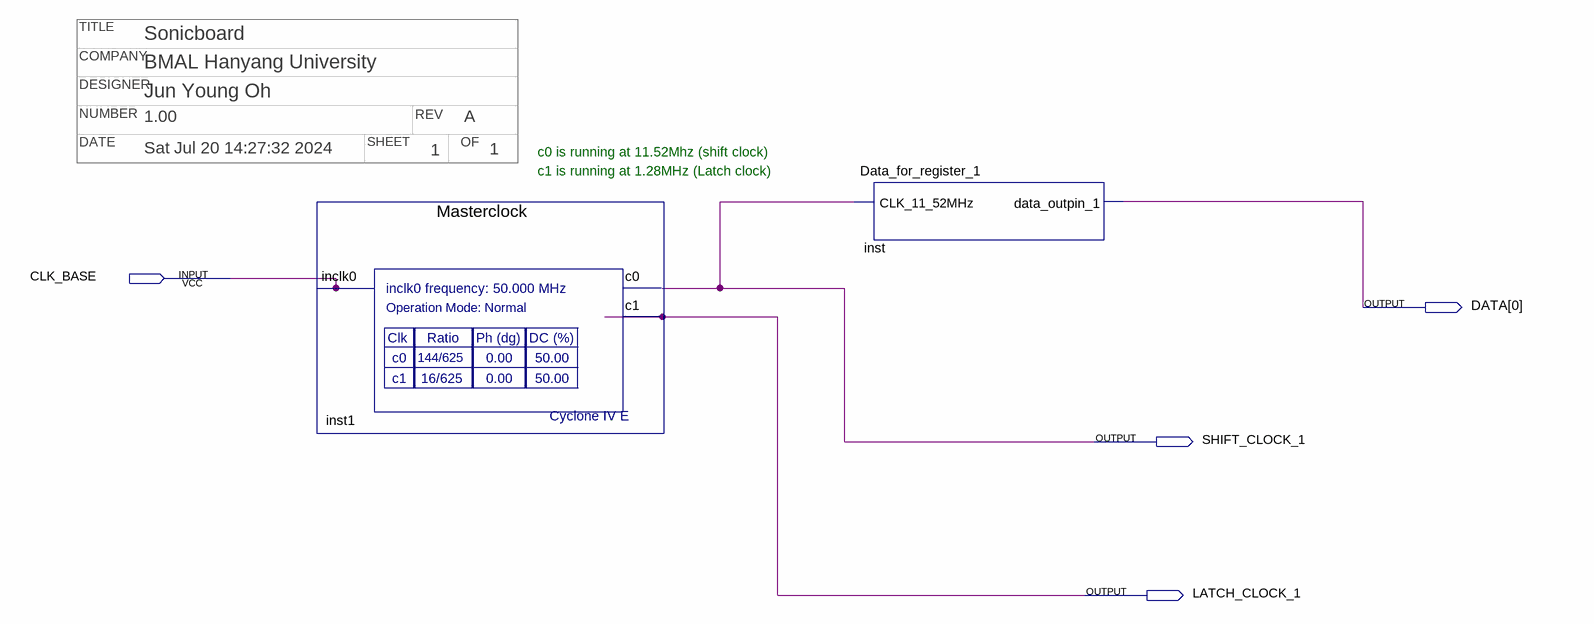
[diagram p0: schematic sheet]
// Quartus schematic Schematic.bdf as structural Verilog: 2 symbols, 4 pins
// Title block: TITLE: Sonicboard; COMPANY: BMAL Hanyang University; DESIGNER: Jun Young Oh; NUMBER: 1.00; REV: A; DATE: Sat Jul 20 14:27:32 2024; SHEET: 1; OF: 1
module Schematic (
  input  CLK_BASE,
  output [0:0] DATA,
  output SHIFT_CLOCK_1,
  output LATCH_CLOCK_1
);

  Masterclock inst1 (.inclk0(CLK_BASE), .c0(SHIFT_CLOCK_1), .c1(LATCH_CLOCK_1));
  Data_for_register_1 inst (.CLK_11_52MHz(SHIFT_CLOCK_1), .data_outpin_1(DATA[0]));

  // Notes on the sheet:
  //   c0 is running at 11.52Mhz (shift clock)
  //   c1 is running at 1.28MHz (Latch clock)
endmodule
